# EAGLE design Receiver (EAGLE 9.6.2)
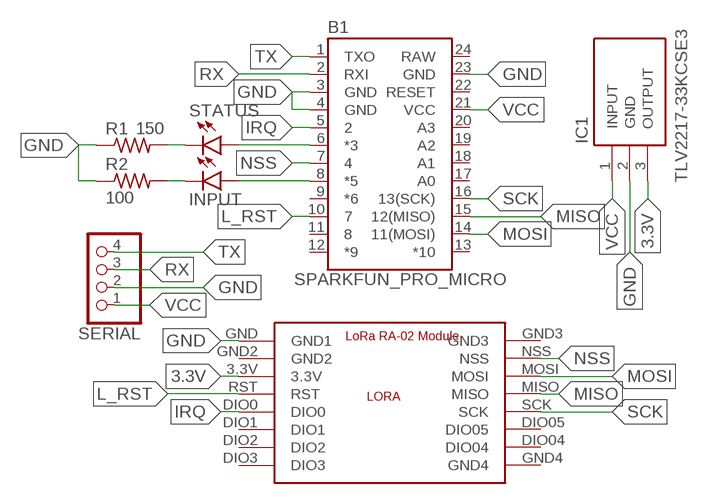
[diagram p0: schematic, sheet 1]

## Parts
B1  SPARKFUN_PRO_MICRO  [SPARKFUN_PRO_MICRO]
IC1  TLV2217-33KCSE3  [TO254P470X1016X1965-3P]
INPUT  LEDSML0805  [SML0805]
LORA  LORA_RA-02_MODULE  [LORA_RA-02_MODULE_FOOTPRINT]
R1  150  R-US_R0805  [R0805]
R2  100  R-US_R0805  [R0805]
SERIAL  PINHD-1X4  [1X04]
STATUS  LEDSML0805  [SML0805]

## Nets
3.3V: IC1.3(OUTPUT) LORA.3.3V
GND: B1.3(GND) B1.4(GND) B1.23(GND) IC1.2(GND) LORA.GND(GND1) R1.1 R2.1 SERIAL.2
IRQ: B1.5 LORA.DIO0
L_RST: B1.10 LORA.RST
MISO: B1.15(12(MISO)) LORA.MISO
MOSI: B1.14(11(MOSI)) LORA.MOSI
N$1: B1.6(*3) STATUS.A
N$3: B1.8(*5) INPUT.A
N$4: INPUT.C R2.2
NSS: B1.7 LORA.NSS
RX: B1.2(RXI) SERIAL.3
SCK: B1.16(13(SCK)) LORA.SCK
STATUS: R1.2 STATUS.C
TX: B1.1(TXO) SERIAL.4
VCC: B1.21(VCC) IC1.1(INPUT) SERIAL.1
Unconnected: B1.9(*6) B1.11 B1.12(*9) B1.13(*10) B1.17(A0) B1.18(A1) B1.19(A2) B1.20(A3) B1.22(RESET) LORA.DIO1 LORA.DIO2 LORA.DIO3 LORA.DIO04 LORA.DIO05 LORA.GND2 LORA.GND3 LORA.GND4

## Power pins joined to a net without a drawn wire
RAW: B1.24(RAW)

## Library data of the parts
B1 = SparkFun-Boards:SPARKFUN_PRO_MICRO: SparkFun Pro Micro Atmega32U4 compatible footprint. SparkFun Products: 3.3V/8MHz <https://www.sparkfun.com/products/12587> 5V/16MHz <https://www.sparkfun.com/products/12640>
IC1 = TLV2217-33KCSE3:TLV2217-33KCSE3: Low-Dropout Fixed-Voltage Regulators Source: Datasheet <http://www.ti.com/lit/gpn/tlv2217>; ARROW_PART_NUMBER: TLV2217-33KCSE3; ARROW_PRICE-STOCK: https://www.arrow.com/en/products/tlv2217-33kcse3/texas-instruments; DESCRIPTION: Low-Dropout Fixed-Voltage Regulators; HEIGHT: 4.7mm; MANUFACTURER_NAME: Texas Instruments; MANUFACTURER_PART_NUMBER: TLV2217-33KCSE3; MOUSER_PART_NUMBER: 595-TLV2217-33KCSE3; MOUSER_PRICE-STOCK: https://www.mouser.co.uk/ProductDetail/Texas-Instruments/TLV2217-33KCSE3?qs=LVErsypW30y56XyeRJBjlA%3D%3D
INPUT STATUS = led:LED: LED OSRAM: - CHIPLED LG R971, LG N971, LY N971, LG Q971, LY Q971, LO R971, LY R971 LH N974, LH R974 LS Q976, LO Q976, LY Q976 LO Q996 - Hyper CHIPLED LW Q18S LB Q993, LB Q99A, LB R99A - SideLED LS A670, LO A670, LY A670, LG A670, LP A670 LB A673, LV A673, LT A673, LW A673 LH A674 LY A675 LS A676, LA A676, LO A676, LY A676, LW A676 LS A679, LY A679, LG A679 - Hyper Micro SIDELED® LS Y876, LA Y876, LO Y876, LY Y876 LT Y87S - SmartLED LW L88C, LW L88S LB L89C, LB L89S, LG L890 LS L89K, LO L89K, LY L89K LS L896, LA L896, LO L896, LY L896 - TOPLED LS T670, LO T670, LY T670, LG T670, LP T670 LSG T670, LSP T670, LSY T670, LOP T670, LYG T670 LG T671, LOG T671, LSG T671 LB T673, LV T673, LT T673, LW T673 LH T674 LS T676, LA T676, LO T676, LY T676, LB T676, LH T676, LSB T676, LW T676 LB T67C, LV T67C, LT T67C, LS T67K, LO T67K, LY T67K, LW E67C LS E67B, LA E67B, LO E67B, LY E67B, LB E67C, LV E67C, LT E67C LW T67C LS T679, LY T679, LG T679 LS T770, LO T770, LY T770, LG T770, LP T770 LB T773, LV T773, LT T773, LW T773 LH T774 LS E675, LA E675, LY E675, LS T675 LS T776, LA T776, LO T776, LY T776, LB T776 LHGB T686 LT T68C, LB T68C - Hyper Mini TOPLED® LB M676 - Mini TOPLED Santana® LG M470 LS M47K, LO M47K, LY M47K Source: http://www.osram.convergy.de LUXEON: - LUMILED® LXK2-PW12-R00, LXK2-PW12-S00, LXK2-PW14-U00, LXK2-PW14-V00 LXK2-PM12-R00, LXK2-PM12-S00, LXK2-PM14-U00 LXK2-PE12-Q00, LXK2-PE12-R00, LXK2-PE12-S00, LXK2-PE14-T00, LXK2-PE14-U00 LXK2-PB12-K00, LXK2-PB12-L00, LXK2-PB12-M00, LXK2-PB14-N00, LXK2-PB14-P00, LXK2-PB14-Q00 LXK2-PR12-L00, LXK2-PR12-M00, LXK2-PR14-Q00, LXK2-PR14-R00 LXK2-PD12-Q00, LXK2-PD12-R00, LXK2-PD12-S00 LXK2-PH12-R00, LXK2-PH12-S00 LXK2-PL12-P00, LXK2-PL12-Q00, LXK2-PL12-R00 Source: www.luxeon.com KINGBRIGHT: KA-3528ASYC Source: www.kingbright.com
LORA = LORA_RA-02_MODULE:LORA_RA-02_MODULE: LoRa Ra-02 module for pin socket.
R1 R2 = rcl:R-US_: RESISTOR, American symbol; SPICEPREFIX: R
SERIAL = pinhead:PINHD-1X4: PIN HEADER

## Board
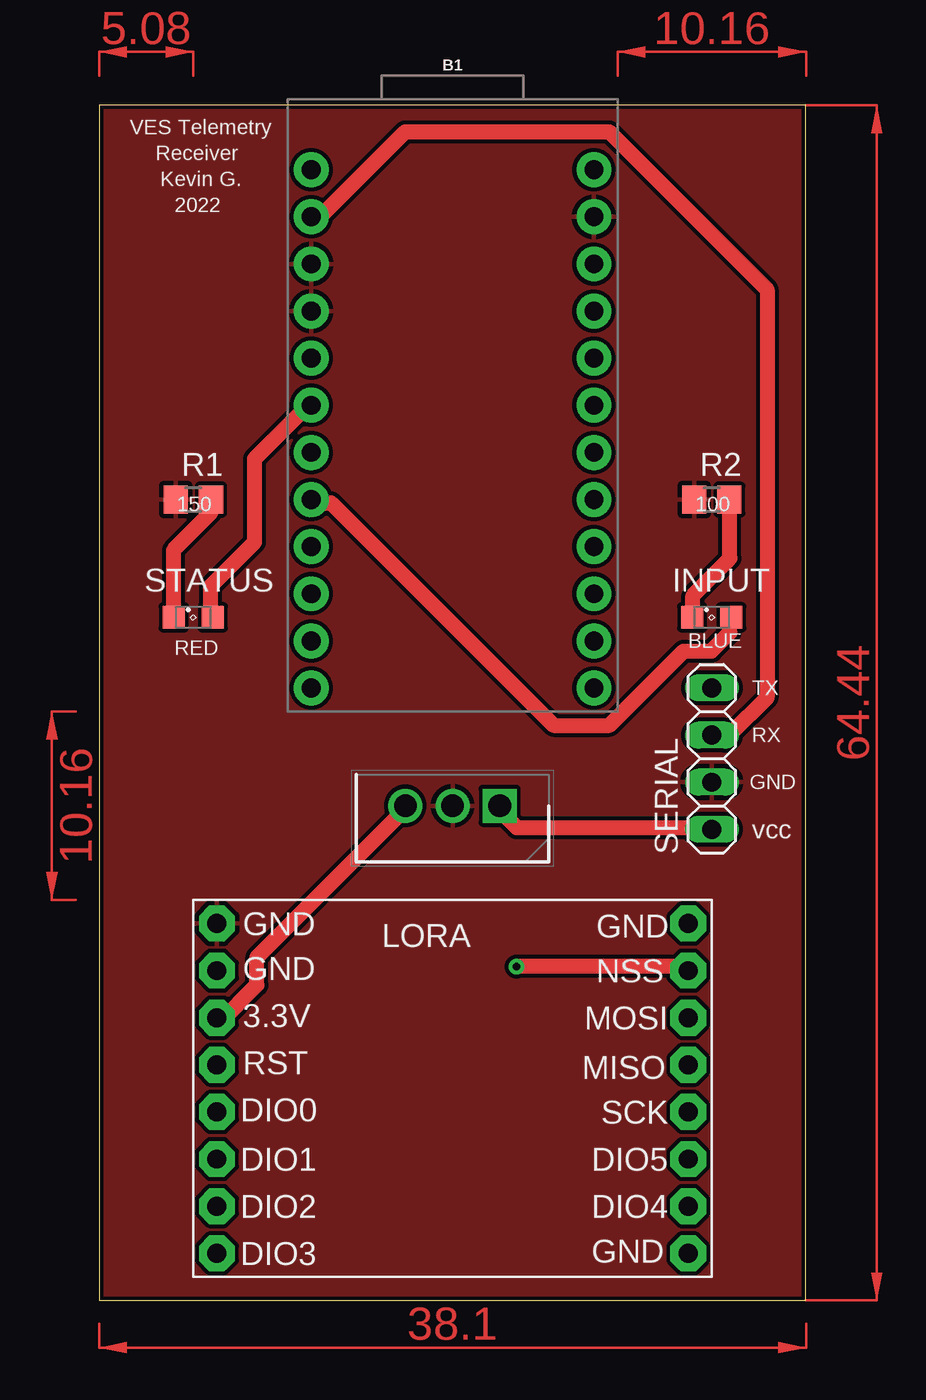
[diagram p1: board, top side]
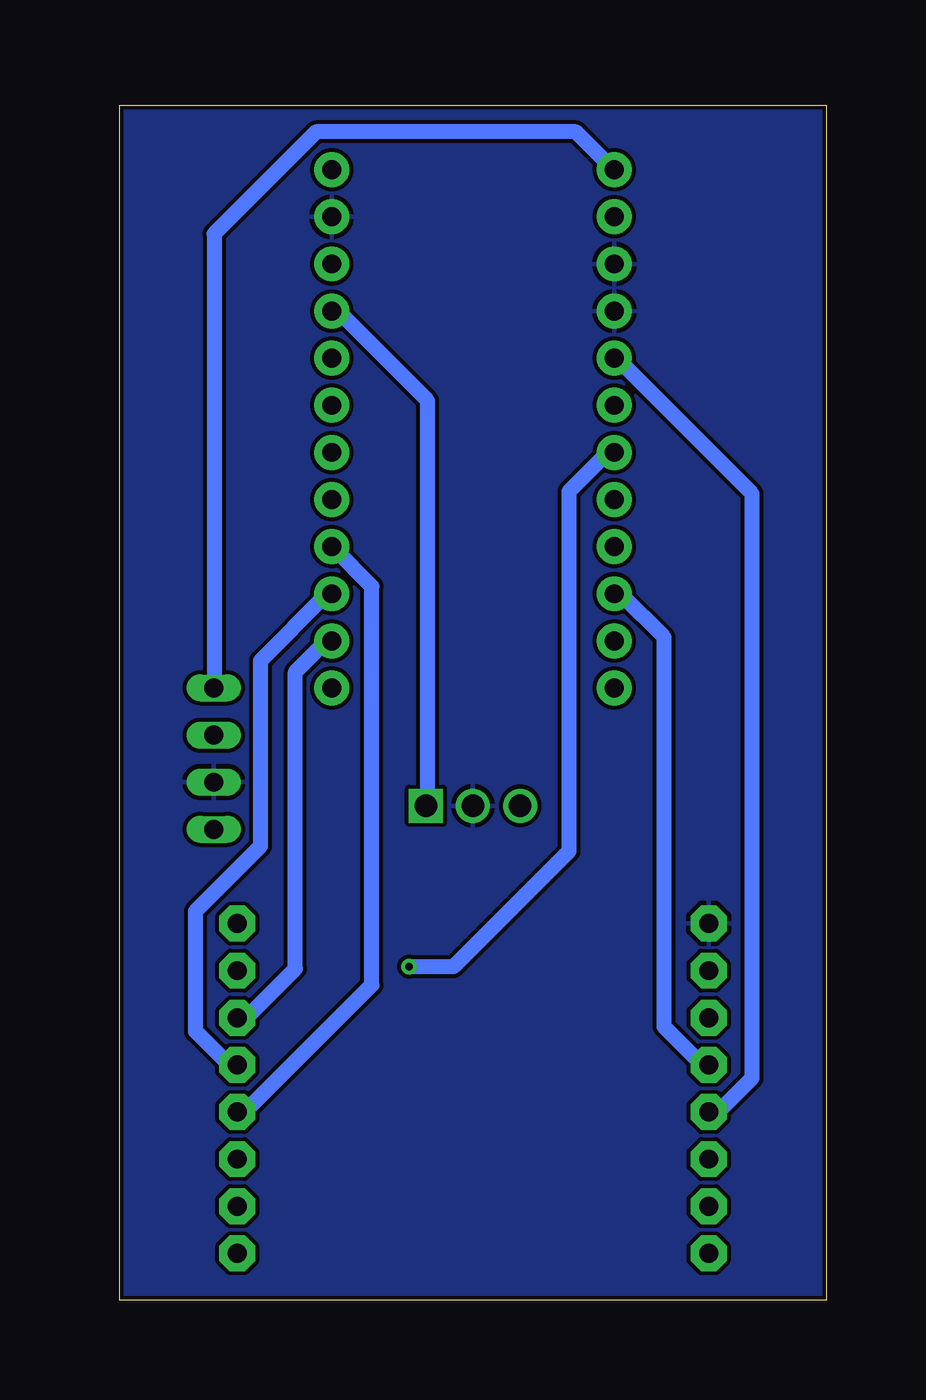
[diagram p2: board, bottom side, seen from below]

Size 38.08 x 64.44 mm. Coordinates in mm from the lower left corner, seen from the top.
Outline: 0,0 38.08,0 38.08,64.44 0,64.44 0,0
Copper layers (1*16): Top 0.035mm / dielectric 1.5mm / Bottom 0.035mm
Design rules "default *": minimum track width 32mil, minimum drill 0.4mm, track to track 0.22mm, track to pad 0.22mm, pad to pad 0.22mm, via to via 0.22mm, smd to smd 0mil, copper to edge 0.22mm, drill to drill 0.6mm, minimum pad ring 0.22mm, minimum via ring 0.22mm, stop-mask expansion 0.05mm, vias tented up to drill 0mil, thermal gap 10mil

### Footprints (pad centres in the part's own frame; a part is rotated, then mirrored left to right if it is on the bottom)
SPARKFUN_PRO_MICRO = drill 1.016 pad 1.88: 1 -7.62,12.7; 2 -7.62,10.16; 3 -7.62,7.62; 4 -7.62,5.08; 5 -7.62,2.54; 6 -7.62,0; 7 -7.62,-2.54; 8 -7.62,-5.08; 9 -7.62,-7.62; 10 -7.62,-10.16; 11 -7.62,-12.7; 12 -7.62,-15.24; 13 7.62,-15.24; 14 7.62,-12.7; 15 7.62,-10.16; 16 7.62,-7.62; 17 7.62,-5.08; 18 7.62,-2.54; 19 7.62,0; 20 7.62,2.54; 21 7.62,5.08; 22 7.62,7.62; 23 7.62,10.16; 24 7.62,12.7
TO254P470X1016X1965-3P = drill 1.22 pad 1.83 square: 1 0,0 | drill 1.22 pad 1.83: 2 2.54,0; 3 5.08,0
SML0805 = smd 1.2 x 1.2: A 1.05,0; C -1.05,0
LORA_RA-02_MODULE_FOOTPRINT = drill 1.016 pad 1.93 octagon: 3.3V -12.7,3.81; DIO0 -12.7,-1.27; DIO1 -12.7,-3.81; DIO2 -12.7,-6.35; DIO3 -12.7,-8.89; DIO04 12.7,-6.35; DIO05 12.7,-3.81; GND -12.7,8.89; GND2 -12.7,6.35; GND3 12.7,8.89; GND4 12.7,-8.89; MISO 12.7,1.27; MOSI 12.7,3.81; NSS 12.7,6.35; RST -12.7,1.27; SCK 12.7,-1.27
R0805 = smd 1.3 x 1.5: 1 -0.95,0; 2 0.95,0
1X04 = drill 1.016 long: 1 -3.81,0; 2 -1.27,0; 3 1.27,0; 4 3.81,0

### Placement (x,y rotation side)
B1  19.05,48.26 0 top
IC1  21.59,26.67 180 top
INPUT  33.02,36.83 0 top
LORA  19.05,11.43 0 top
R1  5.08,43.18 0 top
R2  33.02,43.18 0 top
SERIAL  33.02,29.21 90 top
STATUS  5.08,36.83 0 top

### Tracks (layer width: path | path; a pad name or v marks a point on that pad's centre or on a via)
3.3V
  Top 0.813: IC1.3 16.5,26.5 8.5,18.5 8.5,17 6.5,15 LORA.3.3V
GND
  pour Top: 0,64.77 38.1,64.77 38.1,0 0,0
  pour Bottom: 0,64.77 38.1,64.77 38.1,0 0,0
IRQ
  Bottom 0.813: B1.5 11,50.5 4,43.5 4,12 6,10 LORA.DIO0
L_RST
  Bottom 0.813: B1.10 11,38 8.75,35.75 8.75,14.75 6.5,12.5 LORA.RST
MISO
  Bottom 0.813: B1.15 27,38 30.5,34.5 30.5,24.5 34,21 34,14.5 32,12.5 LORA.MISO
MOSI
  Bottom 0.813: B1.14 27,35.5 28.62,33.88 28.62,17.88 31.5,15 LORA.MOSI
N$1
  Top 0.813: STATUS.A 6,37 6,38.5 8.37,40.87 8.37,45.37 11,48 B1.6
N$3
  Top 0.813: INPUT.A 34,36.5 34,36 33,35 31.5,35 27.5,31 24.5,31 12.5,43 11.5,43 B1.8
N$4
  Top 0.813: INPUT.C 32,37 32,38 34,40 34,43.15 R2.2
NSS  (via drill 0.4)
  Top 0.813: v22.5,18 31.5,18 LORA.NSS
  Bottom 0.813: v22.5,18 20.09,18 13.87,24.22 13.87,43.63 12,45.5 11.5,45.5 B1.7
RX
  Top 0.813: SERIAL.3 33.5,30.5 34,30.5 36,32.5 36,54.5 27.5,63 16.5,63 11.5,58 B1.2
SCK
  Bottom 0.813: B1.16 26.5,40.5 24.5,38.5 24.5,17 31.5,10 LORA.SCK
STATUS
  Top 0.813: STATUS.C 4,37 4,40.45 6.03,42.48 R1.2
TX
  Bottom 0.813: SERIAL.4 33,33.5 33,57.5 27.5,63 13.5,63 11.5,61 B1.1
VCC
  Top 0.813: SERIAL.1 33,25.5 22.5,25.5 21.5,26.5 IC1.1
  Bottom 0.813: B1.21 26.5,53 26,53 21.5,48.5 21.5,27 IC1.1
(copper drawn outside any net)
  shapes: Top area x5

### Text on the board
tNames: VES Telemetry | Receiver | Kevin G. | 2022 | 150 | 100 | RED | BLUE | TX | RX | GND | vcc